# Altium schematic sheet [Module]ReadSingleEncoderABZ.SchDoc: AC
size A4; Author: Nguyen Huu Nghia; CompanyName: MAT; Organization: AD20; Address1: x; Address2: x; Address3: x; Address4: x; DocumentNumber: 1; Revision: V1.0; SheetNumber: 1; SheetTotal: 1
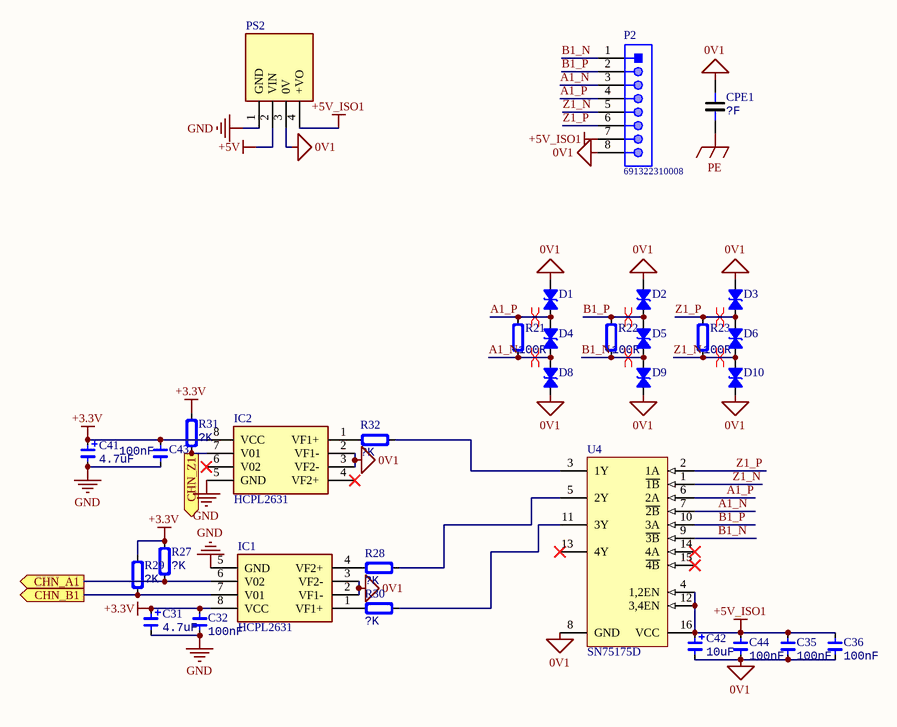
[diagram p0: [Module]ReadSingleEncoderABZ.SchDoc]

## Parts
C31  value 4.7uF  [CAP_TAN_1206]  (hidden comment: C1206)
C32  value 100nF  [CAP-0805]  (hidden comment: Cap_0805)
C35  value 100nF  [CAP-0603]  (hidden comment: Cap_0603)
C36  value 100nF  [CAP-0603]  (hidden comment: Cap_0603)
C41  value 4.7uF  [CAP_TAN_1206]  (hidden comment: C1206)
C42  value 10uF  [CAP_TAN_1206]  (hidden comment: C1206)
C43  value 100nF  [CAP-0805]  (hidden comment: Cap_0805)
C44  value 100nF  [CAP-0603]  (hidden comment: Cap_0603)
CPE1  value ?F  [CN3]  (hidden comment: Cap_PE)
D1  SOD323  [SOD-323]  (value not drawn)
D2  SOD323  [SOD-323]  (value not drawn)
D3  SOD323  [SOD-323]  (value not drawn)
D4  SOD323  [SOD-323]  (value not drawn)
D5  SOD323  [SOD-323]  (value not drawn)
D6  SOD323  [SOD-323]  (value not drawn)
D8  SOD323  [SOD-323]  (value not drawn)
D9  SOD323  [SOD-323]  (value not drawn)
D10  SOD323  [SOD-323]  (value not drawn)
IC1  HCPL2631  [DIP762W56P254L966H508Q8N]
IC2  HCPL2631  [DIP762W56P254L966H508Q8N]
P2  691322310008  [691322310008]
PS2  B2405S-1WR2  [B2405S1WR2]  (value not drawn)
R21  value 100R  [RES-1206]  (hidden comment: Res_1206)
R22  value 100R  [RES-1206]  (hidden comment: Res_1206)
R23  value 100R  [RES-1206]  (hidden comment: Res_1206)
R27  value ?K  [RES-0805]  (hidden comment: Res_0805)
R28  value ?K  [RES-0805]  (hidden comment: Res_0805)
R29  value ?K  [RES-0805]  (hidden comment: Res_0805)
R30  value ?K  [RES-0805]  (hidden comment: Res_0805)
R31  value ?K  [RES-0805]  (hidden comment: Res_0805)
R32  value ?K  [RES-0805]  (hidden comment: Res_0805)
U4  SN75175D  [D0016A_M]

## Ports
CHN_A1 (out), CHN_B1 (out), CHN_Z1 (out)

## Nets
0V1: C35.1 C36.1 C42.2 C44.1 CPE1.2 D1.2(K) D2.2(K) D3.2(K) D8.1(A) D9.1(A) D10.1(A) IC1.2(VF1-) IC1.3(VF2-) IC2.2(VF1-) IC2.3(VF2-) P2.8 PS2.3(0V) U4.8(GND)
+3.3V: C31.1 C32.2 C41.1 C43.2 IC1.8(VCC) IC2.8(VCC) R27.2 R29.2 R31.2
+5V: PS2.2(VIN)
+5V_ISO1: C35.2 C36.2 C42.1 C44.2 P2.7 PS2.4(+VO) U4.4(1,2EN) U4.12(3,4EN) U4.16(VCC)
GND: C31.2 C32.1 C41.2 C43.1 IC1.5(GND) IC2.5(GND) PS2.1(GND)
PE: CPE1.1
A1_N: D4.1(A) D8.2(K) P2.3 R21.1 U4.7(~{2B})
A1_P: D1.1(A) D4.2(K) P2.4 R21.2 U4.6(2A)
B1_N: D5.1(A) D9.2(K) P2.1 R22.1 U4.9(~{3B})
B1_P: D2.1(A) D5.2(K) P2.2 R22.2 U4.10(3A)
CHN_A1: IC1.6(V02) R27.1 ; port CHN_A1
CHN_B1: IC1.7(V01) R29.1 ; port CHN_B1
CHN_Z1: IC2.7(V01) R31.1 ; port CHN_Z1
Z1_N: D6.1(A) D10.2(K) P2.5 R23.1 U4.1(~{1B})
Z1_P: D3.1(A) D6.2(K) P2.6 R23.2 U4.2(1A)
NetIC1_1: IC1.1(VF1+) R30.2
NetIC1_4: IC1.4(VF2+) R28.2
NetIC2_1: IC2.1(VF1+) R32.2
NetR28_1: R28.1 U4.5(2Y)
NetR30_1: R30.1 U4.11(3Y)
NetR32_1: R32.1 U4.3(1Y)

Not connected (* = marked no-connect by the designer): IC2 4(VF2+)* 6(V02)*; U4 13(4Y)* 14(4A)* 15(~{4B})*

## Layout directives
differential pair: A1_N, A1_P, B1_N, B1_P, Z1_N, Z1_P

## Notes on the sheet
- Title
- Size:
- Date:
- A4
- Number:
- Time:
- Revision:
- Sheet
- of
- File:

## Library data of the parts
C31 C41 C42 = Cap_Tan_1206: Capacitor Tantalum; Manufacturer: *
  C42: Note: *
C32 C43 = Cap_0805: Capacitor; Manufacturer: *
C35 C36 C44 = Cap_0603: Capacitor; Manufacturer: *; Note: *
CPE1 = Cap_PE: Capacitor; Manufacturer: *
D1-D6 D8-D10 = Diode_TVS: TVS Diode; Manufacturer: *; Specification: *; Note: *; Value: SOD323
IC1 IC2 = HCPL2631: Integrated Circuit; Manufacturer_Name: ON Semiconductor; Datasheet Link: https://www.onsemi.com/pub/Collateral/HCPL2631-D.PDF; Height: 5.08mm; Manufacturer_Part_Number: HCPL2631; Mouser Part Number: 512-HCPL-2631; Mouser Price/Stock: https://www.mouser.co.uk/ProductDetail/ON-Semiconductor-Fairchild/HCPL2631?qs=WgFN8SqQKV0cGSFMLUo%252BuQ%3D%3D; Arrow Part Number: HCPL2631; Arrow Price/Stock: https://www.arrow.com/en/products/hcpl2631/on-semiconductor
P2 = CMP-1502-01892-1: Serie 322 - 3.81mm Horizontal PCB Header WR-TBL, 8 pin; Manufacturer: Wurth Elektronik; Pin Number: 8; Gender: Male; Operating Temperature: -40to105degC; Mounting Technology: THT; Manufacturer URL: http://www.we-online.de; Package Reference: 691322310008; Packaging: Box; Part Number: 691322310008; Publisher: WurthElektronik; Datasheet URL: http://katalog.we-online.de/em/datasheet/6913223100xx.pdf; Pitch: 3.81mm
PS2 = B2405S-1WR2: Power Supply; Manufacturer_Name: Mornsun; Datasheet Link: https://www.mornsun-power.com/uploads/pdf/B_S-1WR2.pdf; Height: 10.16mm; Manufacturer_Part_Number: B2405S-1WR2
R21-R23 = Res_1206: Resistor; Manufacturer: *
R27-R32 = Res_0805: Resistor; Specification: ±1%; Manufacturer: *; Note: *
U4 = CMP-0310-00152-2: Quadruple Differential Line Receiver, 0 TX / 4 RX, 5V, 0 to 70 degC, 16-Pin SOIC (D), Green (RoHS & no Sb/Br); Manufacturer: Texas Instruments; Supply Voltage(s)(V): 5; ESD(kV): 2; Receivers Per Package: 4; SubFamily: RS-422; Rating: Catalog; ICC(Max)(mA): 70; Footprint: MC3486; Code_JEDEC: MS-012AC; ComponentLink2Description: Package Specification; PackageDescription: 16-Pin Plastic Small Outline Integrated Circuit, 9.9 x 3.9 mm, Pitch 1.27 mm Pitch; # of TX/RX: 0 TX / 4 RX; ComponentLink2URL: http://www.ti.com/litv/pdf/mpds178g; ComponentLink1Description: Datasheet; PartNumber: SN75175D; PackageVersion: revM, Jun-2011; PackageReference: D0016A; ComponentLink1URL: http://www.ti.com/general/docs/lit/getliterature.tsp?genericPartNumber=SN75175&fileType=pdf; Eco-Plan: Green (RoHS & no Sb/Br); Mounting Technology: Surface Mount; Isolated: No; DatasheetVersion: SLLS145C